# EAGLE schematic myDuino_v1.0 (EAGLE 7.1.0)
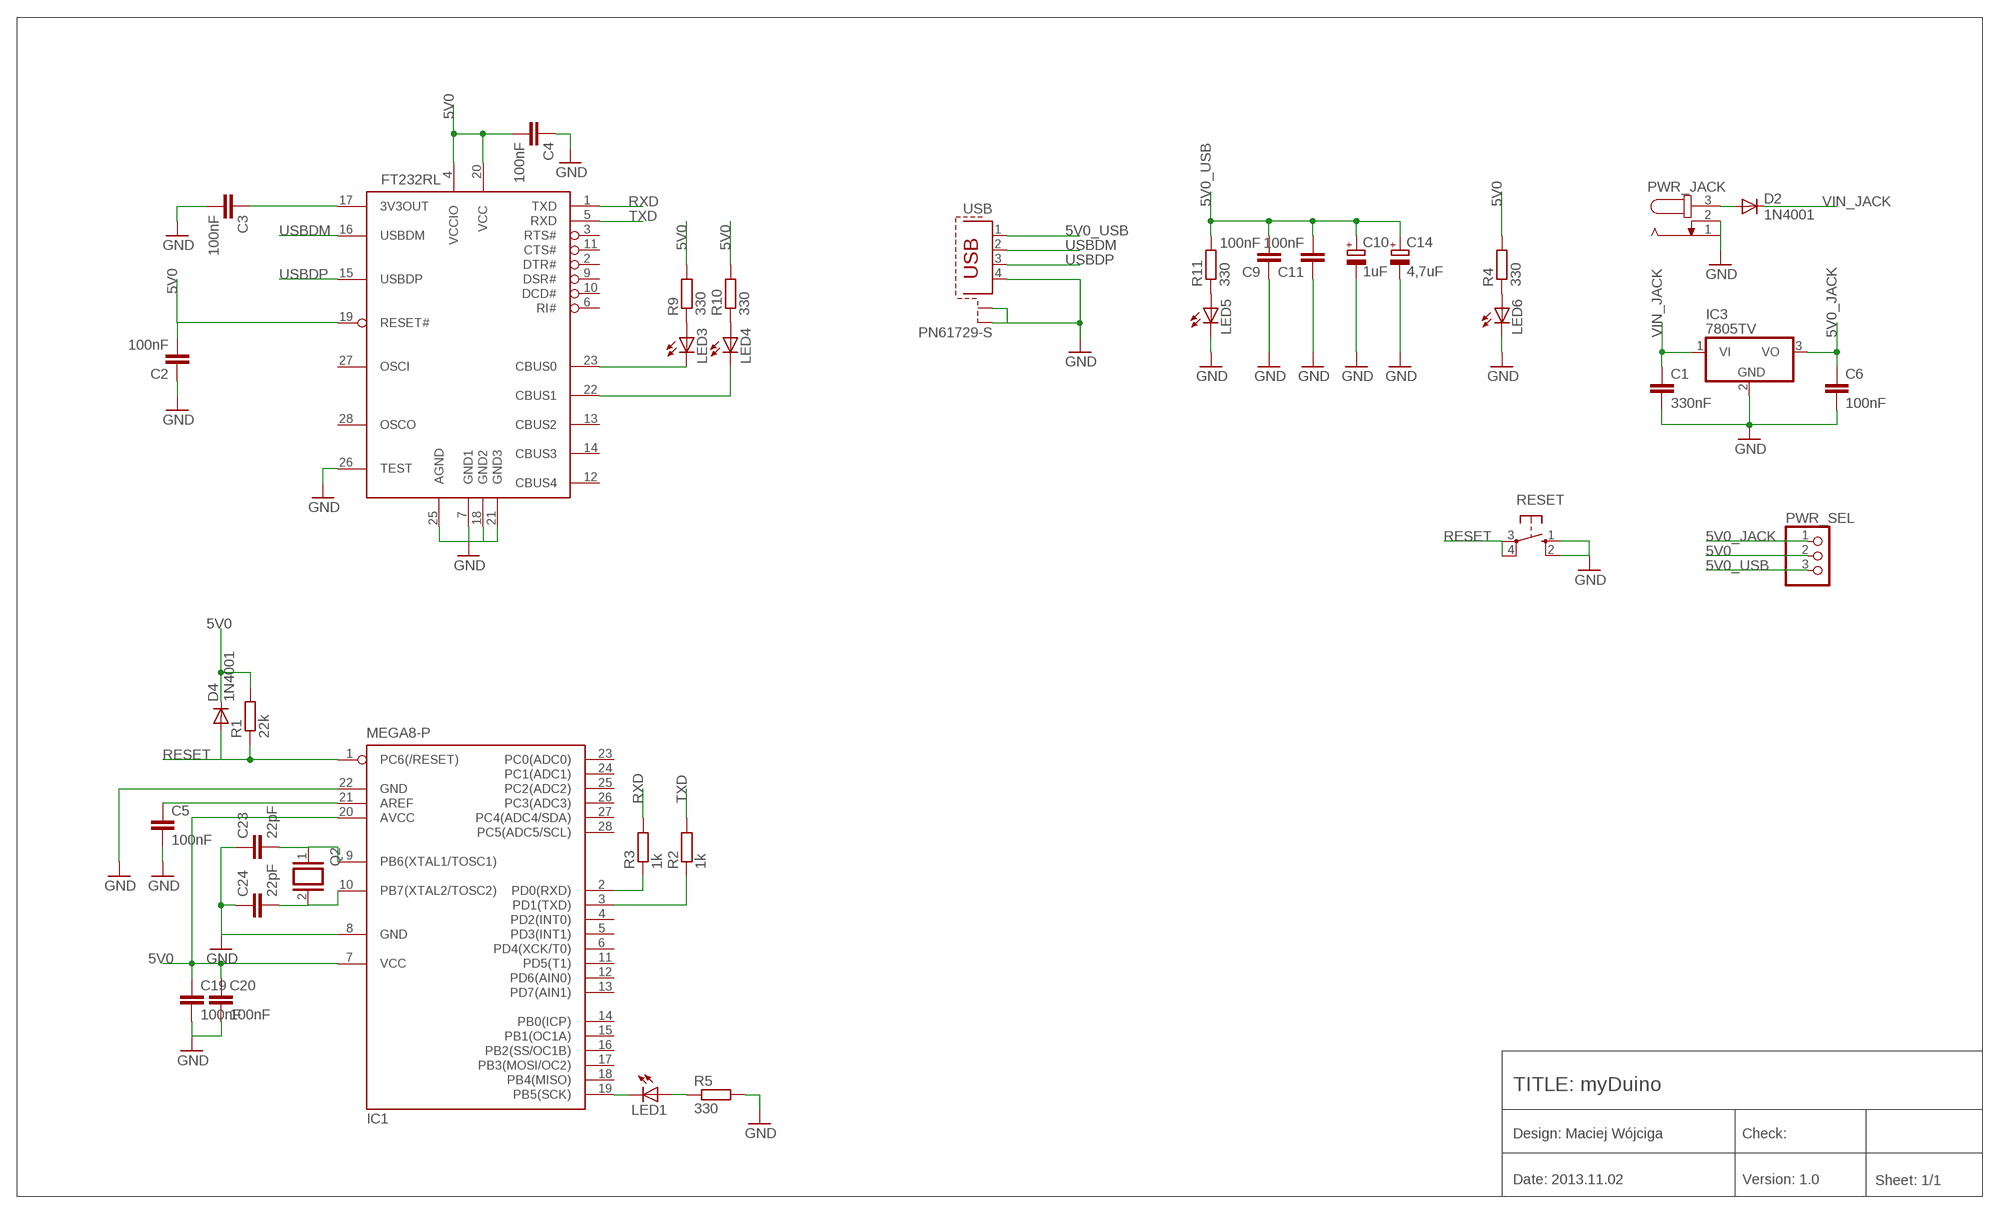
[diagram p0: schematic, sheet 1]

## Parts
C1  330nF  C-EU025-025X050  [C025-025X050]
C2  100nF  C-EU025-025X050  [C025-025X050]
C3  100nF  C-EU025-025X050  [C025-025X050]
C4  100nF  C-EU025-025X050  [C025-025X050]
C5  100nF  C-EU025-025X050  [C025-025X050]
C6  100nF  C-EU025-025X050  [C025-025X050]
C9  100nF  C-EU025-025X050  [C025-025X050]
C10  1uF  CPOL-EUE2.5-5  [E2,5-5]
C11  100nF  C-EU025-025X050  [C025-025X050]
C14  4,7uF  CPOL-EUE2.5-5  [E2,5-5]
C19  100nF  C-EU025-025X050  [C025-025X050]
C20  100nF  C-EU025-025X050  [C025-025X050]
C23  22pF  C-EU025-025X050  [C025-025X050]
C24  22pF  C-EU025-025X050  [C025-025X050]
D2  1N4001  1N4004  [DO41-10]
D4  1N4001  1N4004  [DO41-10]
FT232RL  FT232RL  [SSOP28DB]
IC1  MEGA8-P  [DIL28-3]
IC3  7805TV  [TO220V]
LED1  LED3MM  [LED3MM]
LED3  LED3MM  [LED3MM]
LED4  LED3MM  [LED3MM]
LED5  LED3MM  [LED3MM]
LED6  LED3MM  [LED3MM]
PWR_JACK  JACK-PLUG0  [SPC4077]
PWR_SEL  PINHD-1X3  [1X03]
Q2  XTAL/S  [QS]
R1  22k  R-EU_0207/10  [0207/10]
R2  1k  R-EU_0207/10  [0207/10]
R3  1k  R-EU_0207/10  [0207/10]
R4  330  R-EU_0207/10  [0207/10]
R5  330  R-EU_0207/10  [0207/10]
R9  330  R-EU_0207/10  [0207/10]
R10  330  R-EU_0207/10  [0207/10]
R11  330  R-EU_0207/10  [0207/10]
RESET  10-XX  [B3F-10XX]
USB  PN61729-S  [PN61729-S]

## Nets
5V0: C2.2 C4.2 C19.1 C20.1 D4.C FT232RL.4(VCCIO) FT232RL.19(RESET#) FT232RL.20(VCC) IC1.7(VCC) IC1.20(AVCC) PWR_SEL.2 R1.2 R4.2 R9.2 R10.2
5V0_JACK: C6.1 IC3.3(VO) PWR_SEL.1
5V0_USB: C9.2 C10.+ C11.2 C14.+ PWR_SEL.3 R11.2 USB.1
GND: C1.2 C2.1 C3.2 C4.1 C5.2 C6.2 C9.1 C10.- C11.1 C14.- C19.2 C20.2 C23.1 C24.1 FT232RL.7(GND1) FT232RL.18(GND2) FT232RL.21(GND3) FT232RL.25(AGND) FT232RL.26(TEST) IC1.8(GND) IC1.22(GND) IC3.2(GND) LED5.K(C) LED6.K(C) PWR_JACK.1 PWR_JACK.2 R5.2 RESET.1(S) RESET.2(S1) USB.4 USB.S1 USB.S2
N$1: IC1.3(PD1(TXD)) R2.1
N$2: IC1.2(PD0(RXD)) R3.1
N$3: LED6.A R4.1
N$4: D2.A PWR_JACK.3
N$5: LED1.A R5.1
N$6: IC1.19(PB5(SCK)) LED1.K(C)
N$8: LED3.A R9.1
N$9: LED4.A R10.1
N$10: LED5.A R11.1
N$26: C5.1 IC1.21(AREF)
N$29: C23.2 IC1.9(PB6(XTAL1/TOSC1)) Q2.1
N$35: C24.2 IC1.10(PB7(XTAL2/TOSC2)) Q2.2
N$41: FT232RL.23(CBUS0) LED3.K(C)
N$42: FT232RL.22(CBUS1) LED4.K(C)
N$96: C3.1 FT232RL.17(3V3OUT)
RESET: D4.A IC1.1(PC6(/RESET)) R1.1 RESET.3(P) RESET.4(P1)
RXD: FT232RL.1(TXD) R3.2
TXD: FT232RL.5(RXD) R2.2
USBDM: FT232RL.16(USBDM) USB.2
USBDP: FT232RL.15(USBDP) USB.3
VIN_JACK: C1.1 D2.C IC3.1(VI)
Unconnected: FT232RL.2(DTR#) FT232RL.3(RTS#) FT232RL.6(RI#) FT232RL.9(DSR#) FT232RL.10(DCD#) FT232RL.11(CTS#) FT232RL.12(CBUS4) FT232RL.13(CBUS2) FT232RL.14(CBUS3) FT232RL.27(OSCI) FT232RL.28(OSCO) IC1.4(PD2(INT0)) IC1.5(PD3(INT1)) IC1.6(PD4(XCK/T0)) IC1.11(PD5(T1)) IC1.12(PD6(AIN0)) IC1.13(PD7(AIN1)) IC1.14(PB0(ICP)) IC1.15(PB1(OC1A)) IC1.16(PB2(SS/OC1B)) IC1.17(PB3(MOSI/OC2)) IC1.18(PB4(MISO)) IC1.23(PC0(ADC0)) IC1.24(PC1(ADC1)) IC1.25(PC2(ADC2)) IC1.26(PC3(ADC3)) IC1.27(PC4(ADC4/SDA)) IC1.28(PC5(ADC5/SCL))

## Notes on the sheet
- TITLE: myDuino
- Design: Maciej Wójciga | Check:
- Date: 2013.11.02 | Version: 1.0 | Sheet: 1/1

## Library data of the parts
C1-C6 C9 C11 C19 C20 C23 C24 = rcl:C-EU: CAPACITOR, European symbol
C10 C14 = rcl:CPOL-EU: POLARIZED CAPACITOR, European symbol
D2 D4 = diode:1N4004: DIODE general purpose rectifier, 1 A
FT232RL = ftdichip-5:FT232RL: USB UART 4th Generation USB UART (USB <-> Serial) Controller
IC1 = atmel:MEGA8-P: MICROCONTROLLER 8 Kbytes FLASH, 1 kbytes SRAM, 512 bytes EEPROM, USART, 4-channel 10 bit ADC, 2-channel 8 bit ADC Pin compatible with Atmega48, ATMega88, ATMega168 Source: avr.lbr; OC_FARNELL: unknown; OC_NEWARK: unknown
IC3 = linear:78*: Positive VOLTAGE REGULATOR Source: http://cache.national.com/ds/LM/LM78L05.pdf http://www.fairchildsemi.com/ds/LM/LM7805.pdf
LED1 LED3-LED6 = led:LED: LED OSRAM: - CHIPLED LG R971, LG N971, LY N971, LG Q971, LY Q971, LO R971, LY R971 LH N974, LH R974 LS Q976, LO Q976, LY Q976 LO Q996 - Hyper CHIPLED LW Q18S LB Q993, LB Q99A, LB R99A - SideLED LS A670, LO A670, LY A670, LG A670, LP A670 LB A673, LV A673, LT A673, LW A673 LH A674 LY A675 LS A676, LA A676, LO A676, LY A676, LW A676 LS A679, LY A679, LG A679 - Hyper Micro SIDELED® LS Y876, LA Y876, LO Y876, LY Y876 LT Y87S - SmartLED LW L88C, LW L88S LB L89C, LB L89S, LG L890 LS L89K, LO L89K, LY L89K LS L896, LA L896, LO L896, LY L896 - TOPLED LS T670, LO T670, LY T670, LG T670, LP T670 LSG T670, LSP T670, LSY T670, LOP T670, LYG T670 LG T671, LOG T671, LSG T671 LB T673, LV T673, LT T673, LW T673 LH T674 LS T676, LA T676, LO T676, LY T676, LB T676, LH T676, LSB T676, LW T676 LB T67C, LV T67C, LT T67C, LS T67K, LO T67K, LY T67K, LW E67C LS E67B, LA E67B, LO E67B, LY E67B, LB E67C, LV E67C, LT E67C LW T67C LS T679, LY T679, LG T679 LS T770, LO T770, LY T770, LG T770, LP T770 LB T773, LV T773, LT T773, LW T773 LH T774 LS E675, LA E675, LY E675, LS T675 LS T776, LA T776, LO T776, LY T776, LB T776 LHGB T686 LT T68C, LB T68C - Hyper Mini TOPLED® LB M676 - Mini TOPLED Santana® LG M470 LS M47K, LO M47K, LY M47K Source: http://www.osram.convergy.de LUXEON: - LUMILED® LXK2-PW12-R00, LXK2-PW12-S00, LXK2-PW14-U00, LXK2-PW14-V00 LXK2-PM12-R00, LXK2-PM12-S00, LXK2-PM14-U00 LXK2-PE12-Q00, LXK2-PE12-R00, LXK2-PE12-S00, LXK2-PE14-T00, LXK2-PE14-U00 LXK2-PB12-K00, LXK2-PB12-L00, LXK2-PB12-M00, LXK2-PB14-N00, LXK2-PB14-P00, LXK2-PB14-Q00 LXK2-PR12-L00, LXK2-PR12-M00, LXK2-PR14-Q00, LXK2-PR14-R00 LXK2-PD12-Q00, LXK2-PD12-R00, LXK2-PD12-S00 LXK2-PH12-R00, LXK2-PH12-S00 LXK2-PL12-P00, LXK2-PL12-Q00, LXK2-PL12-R00 Source: www.luxeon.com KINGBRIGHT: KA-3528ASYC Source: www.kingbright.com
PWR_JACK = con-jack:JACK-PLUG: DC POWER JACK Power Jack, DC, Right Angle, Through Hole, Rated 5A at 16VDC, PC Terminals Distributor: Farnell (www.Farnell.de) Drawing: 84N1161.pdf / 84N1162.pdf Manufacturer: SPC Technology (www.spctechnology.com) Type: SPC4077 / SPC 4078; OC_FARNELL: unknown; OC_NEWARK: unknown
PWR_SEL = pinhead:PINHD-1X3: PIN HEADER
Q2 = special:XTAL/S: CRYSTAL
R1-R5 R9-R11 = rcl:R-EU_: RESISTOR, European symbol
RESET = switch-omron:10-XX: OMRON SWITCH; MPN: B3F-1000; OC_FARNELL: 176432; OC_NEWARK: 36M3542
USB = con-berg:PN61729-S: BERG USB connector; OC_FARNELL: unknown; OC_NEWARK: unknown

## Net classes
0 default: width 0.203 mm